# EAGLE design DRV8411A Module Rev. B (EAGLE 9.6.2)
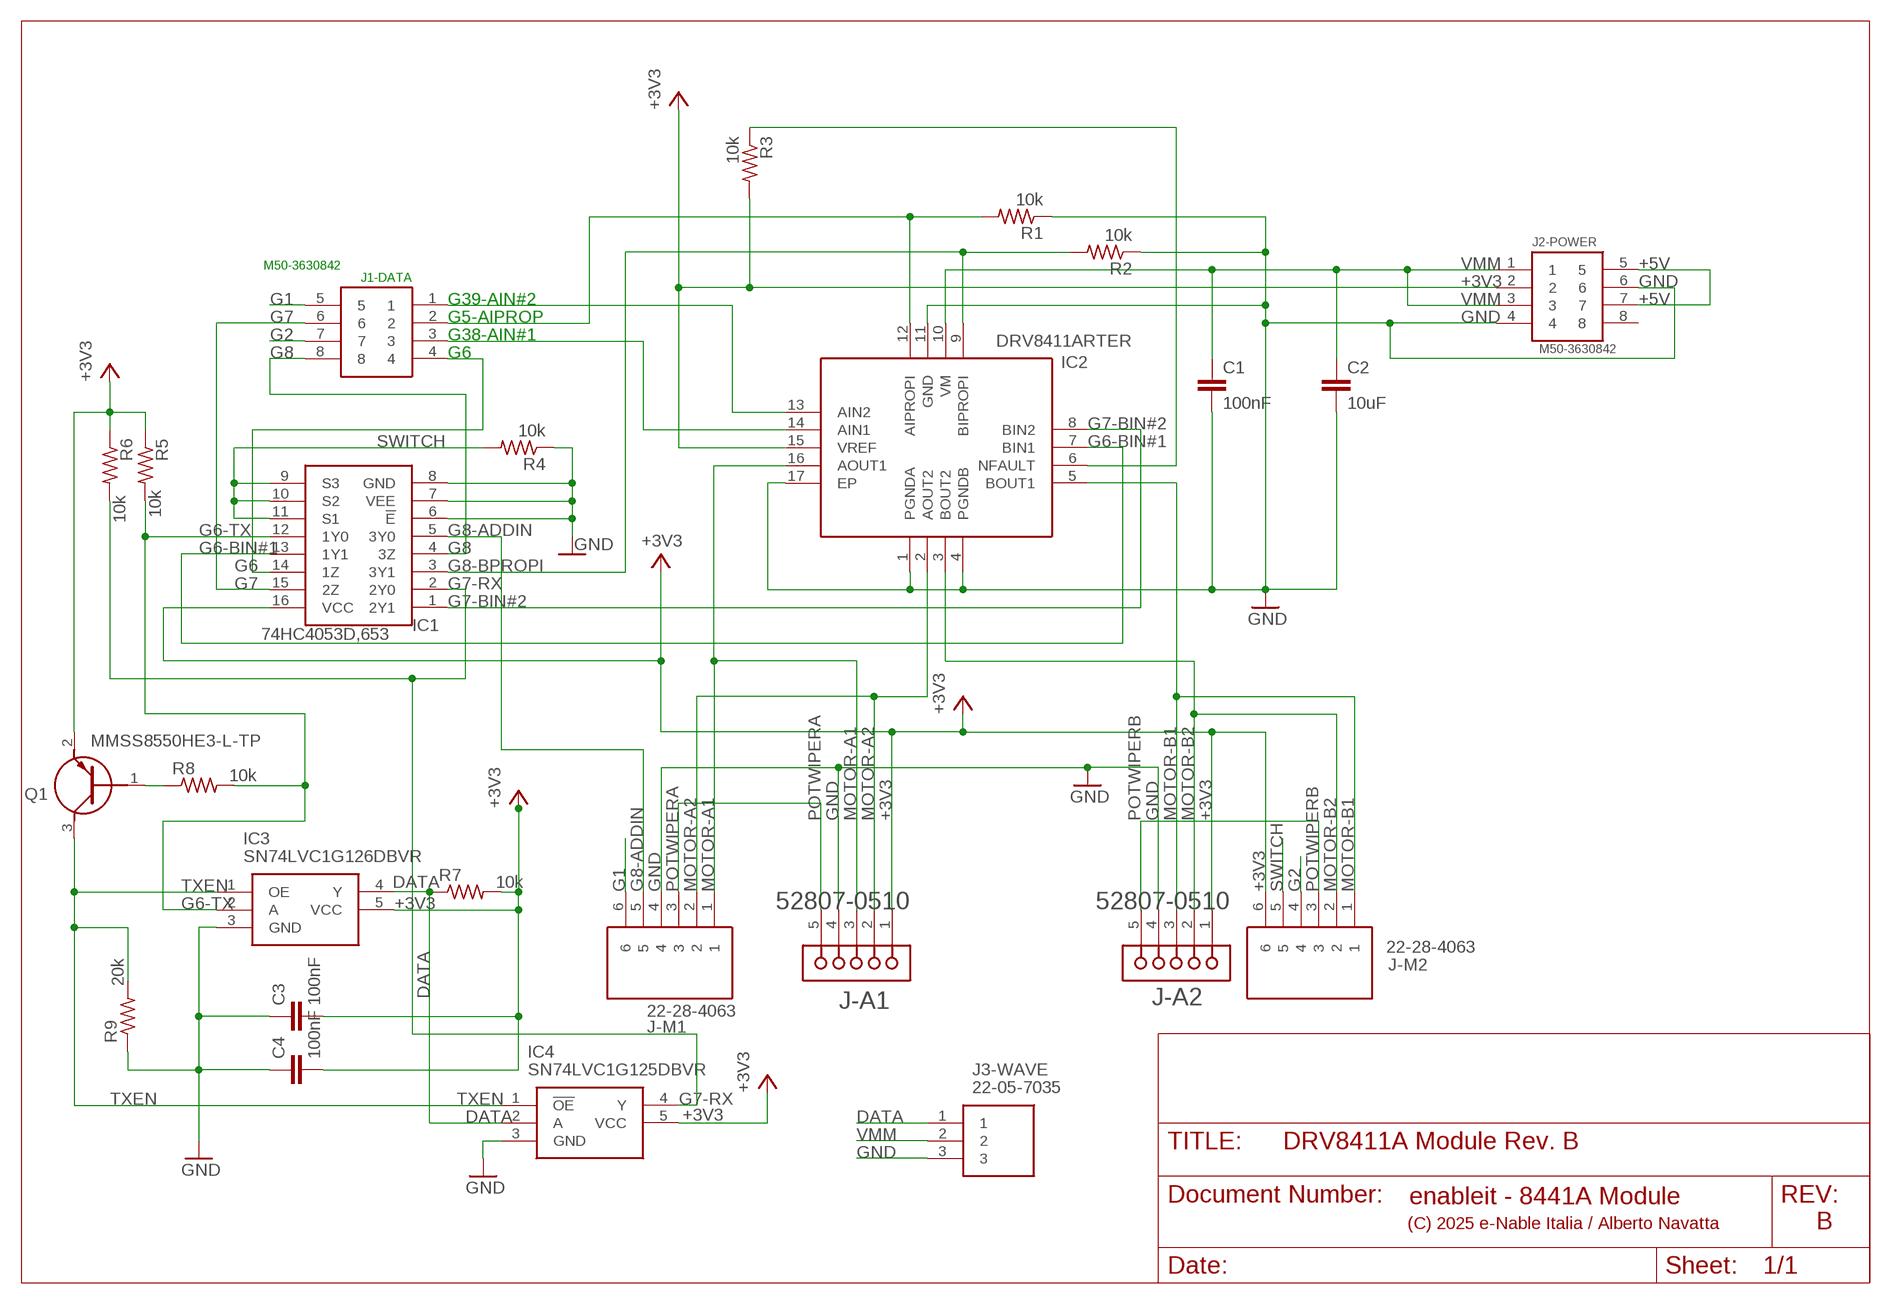
[diagram p0: schematic, sheet 1]

## Parts
C1  100nF  C-EUC0603  [C0603]
C2  10uF  C-EUC1206  [C1206]
C3  100nF  C-EUC0603  [C0603]
C4  100nF  C-EUC0603  [C0603]
IC1  74HC4053D,653  [SOIC127P600X175-16N]
IC2  DRV8411ARTER  [QFN50P300X300X80-17N]
IC3  SN74LVC1G126DBVR  [SOT95P280X145-5N]
IC4  SN74LVC1G125DBVR  [SOT95P280X145-5N]
J1-DATA  M50-3630842  [HUSRSP8W42P127_1016X210X430P]
J2-POWER  M50-3630842  [HUSRSP8W42P127_1016X210X430P]
J3-WAVE  22-05-7035  [SHDRRA3W60P0X250_1X3_990X790X4]
J-A1  MOLEX_52807-0510MOLEX_52807-0510_0_0  [MOLEX_52807-0510_0]
J-A2  MOLEX_52807-0510MOLEX_52807-0510_0_0  [MOLEX_52807-0510_0]
J-M1  22-28-4063  [HDRV6W66P0X254_1X6_1524X249X83]
J-M2  22-28-4063  [HDRV6W66P0X254_1X6_1524X249X83]
Q1  MMSS8550HE3-L-TP  [SOT95P237X125-3N]
R1  10k  R-US_R1206  [R1206]
R2  10k  R-US_R1206  [R1206]
R3  10k  R-US_R1206  [R1206]
R4  10k  R-US_R1206  [R1206]
R5  10k  R-US_R1206  [R1206]
R6  10k  R-US_R1206  [R1206]
R7  10k  R-US_R1206  [R1206]
R8  10k  R-US_R1206  [R1206]
R9  20k  R-US_R1206  [R1206]

## Nets
+3V3: C3.2 C4.2 IC1.16(VCC) IC2.15(VREF) IC3.5(VCC) IC4.5(VCC) J2-POWER.2 J-A1.1 J-A2.1 J-M2.6 Q1.2(E) R3.2 R5.1 R6.1 R7.2
+5V: J2-POWER.5 J2-POWER.7
DATA: IC3.4(Y) IC4.2(A) J3-WAVE.1 R7.1
G1: J1-DATA.5 J-M1.6
G2: J1-DATA.7 J-M2.4
G5-AIPROP: IC2.12(AIPROPI) J1-DATA.2 R1.2
G6: IC1.14(1Z) J1-DATA.4
G6-BIN#1: IC1.13(1Y1) IC2.7(BIN1)
G6-TX: IC1.12(1Y0) IC3.2(A) R5.2 R8.2
G7: IC1.15(2Z) J1-DATA.6
G7-BIN#2: IC1.1(2Y1) IC2.8(BIN2)
G7-RX: IC1.2(2Y0) IC4.4(Y) R6.2
G8: IC1.4(3Z) J1-DATA.8
G8-ADDIN: IC1.5(3Y0) J-M1.5
G8-BPROPI: IC1.3(3Y1) IC2.9(BIPROPI) R2.2
G38-AIN#1: IC2.14(AIN1) J1-DATA.3
G39-AIN#2: IC2.13(AIN2) J1-DATA.1
GND: C1.2 C2.2 C3.1 C4.1 IC1.6(!E) IC1.7(VEE) IC1.8(GND) IC2.1(PGNDA) IC2.4(PGNDB) IC2.11(GND) IC2.17(EP) IC3.3(GND) IC4.3(GND) J2-POWER.4 J2-POWER.6 J3-WAVE.3 J-A1.4 J-A2.4 J-M1.4 R1.1 R2.1 R4.1 R9.1
MOTOR-A1: IC2.16(AOUT1) J-A1.3 J-M1.1
MOTOR-A2: IC2.2(AOUT2) J-A1.2 J-M1.2
MOTOR-B1: IC2.5(BOUT1) J-A2.3 J-M2.1
MOTOR-B2: IC2.3(BOUT2) J-A2.2 J-M2.2
N$1: Q1.1(B) R8.1
NFAULT: IC2.6(NFAULT) R3.1
POTWIPERA: J-A1.5 J-M1.3
POTWIPERB: J-A2.5 J-M2.3
SWITCH: IC1.9(S3) IC1.10(S2) IC1.11(S1) J-M2.5 R4.2
TXEN: IC3.1(OE) IC4.1(!OE) Q1.3(C) R9.2
VMM [Power]: C1.1 C2.1 IC2.10(VM) J2-POWER.1 J2-POWER.3 J3-WAVE.2
Unconnected: J2-POWER.8

## Notes on the sheet
- enableit - 8441A Module
- (C) 2025 e-Nable Italia / Alberto Navatta | B

## Library data of the parts
C1-C4 = rcl:C-EU: CAPACITOR, European symbol; SPICEPREFIX: C
IC1 = SamacSys_Parts:74HC4053D,653: 74HC(T)4053 - Triple 2-channel analog multiplexer/demultiplexer@en-us Source: Datasheet <https://assets.nexperia.com/documents/data-sheet/74HC_HCT4053.pdf>; DESCRIPTION: 74HC(T)4053 - Triple 2-channel analog multiplexer/demultiplexer@en-us; HEIGHT: 1.75mm; MANUFACTURER_NAME: Nexperia; MANUFACTURER_PART_NUMBER: 74HC4053D,653; MOUSER_PART_NUMBER: 771-74HC4053D-T; MOUSER_PRICE-STOCK: https://www.mouser.co.uk/ProductDetail/Nexperia/74HC4053D653?qs=P62ublwmbi%2F49q4%252B0dLSpg%3D%3D
IC2 = SamacSys_Parts:DRV8411ARTER: Motor / Motion / Ignition Controllers & Drivers 1.65-V to 11-V, 4-A dual H-bridge motor driver with IPROPI current regulation Source: Datasheet <https://www.ti.com/product/DRV8411A/part-details/DRV8411ARTER>; DESCRIPTION: Motor / Motion / Ignition Controllers & Drivers 1.65-V to 11-V, 4-A dual H-bridge motor driver with IPROPI current regulation; HEIGHT: 0.8mm; MANUFACTURER_NAME: Texas Instruments; MANUFACTURER_PART_NUMBER: DRV8411ARTER; MOUSER_PART_NUMBER: 595-DRV8411ARTER; MOUSER_PRICE-STOCK: https://www.mouser.co.uk/ProductDetail/Texas-Instruments/DRV8411ARTER?qs=Jm2GQyTW%2FbhTQDH4ldRJVg%3D%3D
IC3 = SamacSys_Parts:SN74LVC1G126DBVR: Texas Instruments SN74LVC1G126DBVR, Buffer 3-State, Non-Inverting, 1.65 5.5 V, 5-Pin SOT-23 Source: Datasheet <http://www.ti.com/lit/ds/symlink/sn74lvc1g126.pdf>; DESCRIPTION: Texas Instruments SN74LVC1G126DBVR, Buffer 3-State, Non-Inverting, 1.65 5.5 V, 5-Pin SOT-23; HEIGHT: 1.45mm; MANUFACTURER_NAME: Texas Instruments; MANUFACTURER_PART_NUMBER: SN74LVC1G126DBVR; MOUSER_PART_NUMBER: 595-SN74LVC1G126DBVR; MOUSER_PRICE-STOCK: https://www.mouser.co.uk/ProductDetail/Texas-Instruments/SN74LVC1G126DBVR?qs=pajgIaoyDUi3T2WgNNfd3w%3D%3D
IC4 = SamacSys_Parts:SN74LVC1G125DBVR: SN74LVC1G125DBVR, Bus Buffer, LVC, 4 @ 5 Vns, 32mA 1.65 to 5.5V 5-Pin SOT-23 Source: Datasheet <http://www.ti.com/lit/ds/symlink/sn74lvc1g125.pdf>; DESCRIPTION: SN74LVC1G125DBVR, Bus Buffer, LVC, 4 @ 5 Vns, 32mA 1.65 to 5.5V 5-Pin SOT-23; HEIGHT: 1.45mm; MANUFACTURER_NAME: Texas Instruments; MANUFACTURER_PART_NUMBER: SN74LVC1G125DBVR; MOUSER_PART_NUMBER: 595-SN74LVC1G125DBVR; MOUSER_PRICE-STOCK: https://www.mouser.co.uk/ProductDetail/Texas-Instruments/SN74LVC1G125DBVR?qs=dT9u2OTAaVWCjkJK89JQQg%3D%3D
J1-DATA J2-POWER = SamacSys_Parts:M50-3630842: 1.27mm (0.05") Pitch SIL Vertical SMT Pin Header, selective gold + tin, 8 contacts Source: Datasheet <https://cdn.harwin.com/pdfs/M50-363.pdf>; DESCRIPTION: 1.27mm (0.05") Pitch SIL Vertical SMT Pin Header, selective gold + tin, 8 contacts; HEIGHT: mm; MANUFACTURER_NAME: Harwin; MANUFACTURER_PART_NUMBER: M50-3630842; MOUSER_PART_NUMBER: 855-M50-3630842; MOUSER_PRICE-STOCK: https://www.mouser.co.uk/ProductDetail/Harwin/M50-3630842?qs=%252BdQmOuGyFcFqwDSPVZ2BSw%3D%3D
J3-WAVE = SamacSys_Parts:22-05-7035: Headers & Wire Housings 3 CKT 2.5MM R/A HDR Source: Datasheet <https://www.molex.com/pdm_docs/sd/022057035_sd.pdf>; DESCRIPTION: Headers & Wire Housings 3 CKT 2.5MM R/A HDR; HEIGHT: 4.9mm; MANUFACTURER_NAME: Molex; MANUFACTURER_PART_NUMBER: 22-05-7035; MOUSER_PART_NUMBER: 538-22-05-7035; MOUSER_PRICE-STOCK: https://www.mouser.co.uk/ProductDetail/Molex/22-05-7035?qs=Crveo0%2FlhpeTQWWlghVCyA%3D%3D
J-A1 J-A2 = Molex - 52807-0510:MOLEX_52807-0510: MOLX-52807-0510; CIIVA_IDS: 3407603; CIRCUITS_LOADED: 5; COMPONENT_LINK_1_DESCRIPTION: Manufacturer URL; COMPONENT_LINK_1_URL: http://www.molex.com/molex/index.jsp; COMPONENT_LINK_3_DESCRIPTION: Package Specification; COMPONENT_LINK_3_URL: http://www.molex.com/pdm_docs/sd/528070510_sd.pdf; CONTACT_POSITION: Top; CURRENT_MAX_PER_CONTACT: 0.2A, 0.4A, 0.5A; DATASHEET: http://www.molex.com/webdocs/datasheets/pdf/en-us/0528070510_FFC_FPC_CONNECTORS.pdf; ENTRY_ANGLE: 90degrees Angle; FOOTPRINT_VARIANT_NAME_0: Manufacturer Recommended; IMPORTED: yes; IMPORTED_FROM: vault; IMPORT_TS: 1521841804; MATED_HEIGHT: 3.60mm; MATERIAL___METAL: Phosphor Bronze; MATERIAL___PLATING_MATING: Tin; MATERIAL___PLATING_TERMINATION: Tin; MF: Molex; MOUNTING_TECHNOLOGY: Through Hole; MPN: 52807-0510; NUMBER_OF_ROWS: 1; ORIENTATION: Right Angle; PACKAGE: 52807-0510; PACKAGE_DESCRIPTION: 5-Lead FFC Connector, Pitch 1.0 mm; PACKAGE_VERSION: Rev. B, 08/2002; PACKING: Tray; PCB_RETENTION: None; PITCH___MATING_INTERFACE: 1.00mm; PITCH___TERMINATION_INTERFACE: 1.00mm; POLARIZED_TO_PCB: Yes; PREFIX: J; RELEASE_DATE: 1411372626; ROHS: Yes; STACKABLE: No; VAULT_GUID: C91CB896-1E32-4DB6-8F6C-FD3BFAFEC20D; VAULT_REVISION: BD038269-A002-43D0-B0A9-6B73FA1A6DCF; VOLTAGE_MAX: 50V
J-M1 J-M2 = SamacSys_Parts:22-28-4063: Headers & Wire Housings BREAKAWAY HDR VERT 6 Source: Datasheet <https://www.molex.com/pdm_docs/sd/022284063_sd.pdf>; DESCRIPTION: Headers & Wire Housings BREAKAWAY HDR VERT 6; HEIGHT: 8.38mm; MANUFACTURER_NAME: Molex; MANUFACTURER_PART_NUMBER: 22-28-4063; MOUSER_PART_NUMBER: 538-22-28-4063; MOUSER_PRICE-STOCK: https://www.mouser.co.uk/ProductDetail/Molex/22-28-4063?qs=MuwpYaHj750CQ%2FtWum2FiQ%3D%3D
Q1 = SamacSys_Parts:MMSS8550HE3-L-TP: Small Signal Bipolar Transistors Source: Datasheet <https://mccsemi.com/pdf/Products/MMSS8550HE3(SOT-23).pdf>; DESCRIPTION: Small Signal Bipolar Transistors; HEIGHT: 1.25mm; MANUFACTURER_NAME: MCC; MANUFACTURER_PART_NUMBER: MMSS8550HE3-L-TP; MOUSER_PART_NUMBER: 833-MMSS8550HE3-L-TP; MOUSER_PRICE-STOCK: https://www.mouser.co.uk/ProductDetail/Micro-Commercial-Components-MCC/MMSS8550HE3-L-TP?qs=HBWAp0VN4RgYknoAqeuZgg%3D%3D
R1-R9 = rcl:R-US_: RESISTOR, American symbol; SPICEPREFIX: R

## Net classes
2 Power: width 0.203 mm

## Board
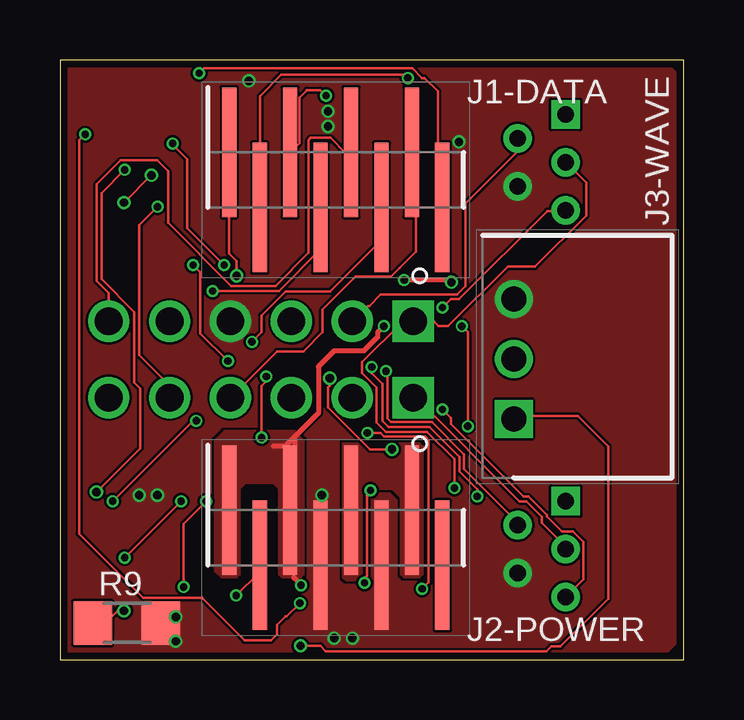
[diagram p1: board, top side]
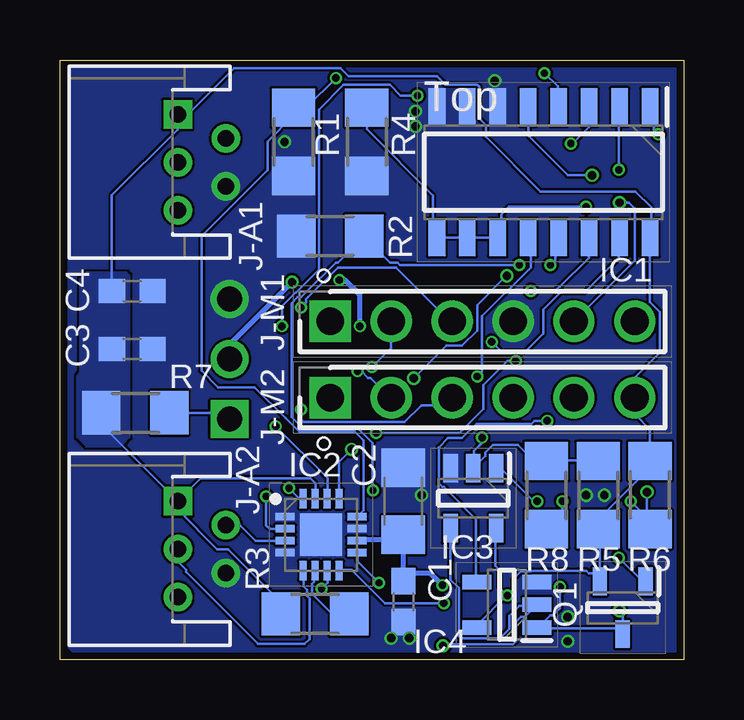
[diagram p2: board, bottom side, seen from below]

Size 26 x 25 mm. Coordinates in mm from the lower left corner, seen from the top.
Outline: 0,0 26,0 26,25 0,25 0,0
Copper layers (1*16): Top 0.035mm / dielectric 1.5mm / Bottom 0.035mm
Design rules "PCBWay_2L_100um-Track": minimum track width 0.1mm, minimum drill 0.3mm, track to track 0.1mm, track to pad 0.1mm, pad to pad 0.1mm, via to via 0.1mm, smd to smd 0mil, copper to edge 0.3mm, drill to drill 10mil, minimum pad ring 6mil, minimum via ring 0.1mm, stop-mask expansion 2mil, vias tented up to drill 0.45mm, thermal gap 0.2mm

### Footprints (pad centres in the part's own frame; a part is rotated, then mirrored left to right if it is on the bottom)
C0603 = smd 1.1 x 1: 1 -0.85,0; 2 0.85,0
C1206 = smd 1.6 x 1.8: 1 -1.4,0; 2 1.4,0
SOIC127P600X175-16N = smd 1.55 x 0.7: 1 -2.725,4.445; 2 -2.725,3.175; 3 -2.725,1.905; 4 -2.725,0.635; 5 -2.725,-0.635; 6 -2.725,-1.905; 7 -2.725,-3.175; 8 -2.725,-4.445; 9 2.725,-4.445; 10 2.725,-3.175; 11 2.725,-1.905; 12 2.725,-0.635; 13 2.725,0.635; 14 2.725,1.905; 15 2.725,3.175; 16 2.725,4.445
QFN50P300X300X80-17N = smd 0.8 x 0.3: 1 -1.5,0.75; 2 -1.5,0.25; 3 -1.5,-0.25; 4 -1.5,-0.75; 9 1.5,-0.75; 10 1.5,-0.25; 11 1.5,0.25; 12 1.5,0.75 | smd 0.3 x 0.8: 5 -0.75,-1.5; 6 -0.25,-1.5; 7 0.25,-1.5; 8 0.75,-1.5; 13 0.75,1.5; 14 0.25,1.5; 15 -0.25,1.5; 16 -0.75,1.5 | smd 1.76 x 1.76: 17 0,0
SOT95P280X145-5N = smd 1.2 x 0.6: 1 -1.25,0.95; 2 -1.25,0; 3 -1.25,-0.95; 4 1.25,-0.95; 5 1.25,0.95
HUSRSP8W42P127_1016X210X430P = smd 0.6 x 5.4: 1 -4.445,1.15; 2 -3.175,-1.15; 3 -1.905,1.15; 4 -0.635,-1.15; 5 0.635,1.15; 6 1.905,-1.15; 7 3.175,1.15; 8 4.445,-1.15
SHDRRA3W60P0X250_1X3_990X790X4 = drill 1.05 pad 1.575 square: 1 0,0 | drill 1.05 pad 1.575: 2 -2.5,0; 3 -5,0
MOLEX_52807-0510_0 = drill 0.7 pad 1.2 square: 1 0,0 | drill 0.7 pad 1.2: 2 1,2; 3 2,0; 4 3,2; 5 4,0
HDRV6W66P0X254_1X6_1524X249X83 = drill 1.15 pad 1.725 square: 1 0,0 | drill 1.15 pad 1.725: 2 2.54,0; 3 5.08,0; 4 7.62,0; 5 10.16,0; 6 12.7,0
SOT95P237X125-3N = smd 1.15 x 0.6: 1 -1.1,0.95; 2 -1.1,-0.95; 3 1.1,0
R1206 = smd 1.6 x 1.803: 1 -1.422,0; 2 1.422,0

### Placement (x,y rotation side)
C1  11.68,2.41 270 bottom
C2  11.68,6.6 90 bottom
C3  22.99,12.95 180 bottom
C4  22.99,15.37 180 bottom
IC1  5.84,20.32 270 bottom
IC2  15.11,5.21 0 bottom
IC3  8.76,6.73 270 bottom
IC4  7.37,2.29 180 bottom
J1-DATA  11.5,20 0 top
J2-POWER  11.5,5.08 0 top
J3-WAVE  18.92,10.03 270 top
J-A1  21.08,22.73 270 bottom
J-A2  21.08,6.6 270 bottom
J-M1  14.73,14.1 0 bottom
J-M2  14.73,10.92 0 bottom
Q1  2.54,2.16 270 bottom
R1  16.26,21.59 90 bottom
R2  14.73,17.65 0 bottom
R3  15.37,1.91 180 bottom
R4  13.21,21.59 90 bottom
R5  3.56,6.86 90 bottom
R6  1.4,6.86 270 bottom
R7  22.86,10.29 180 bottom
R8  5.71,6.86 90 bottom
R9  2.79,1.52 180 top

### Tracks (layer width: path | path; a pad name or v marks a point on that pad's centre or on a via)
+3V3  (via drill 0.3)
  Top 0.1: v7.35,2.67 8.3,3.62 8.3,3.9 J2-POWER.2
  Bottom 0.1: IC2.15 15.35,6.75 15.35,7.35 15.55,7.55 20.14,7.55 J-A2.1 | R3.2 16.8,1.95 16.8,2.4 19,4.6 19.45,4.6 21.08,6.23 J-A2.1 | IC3.5 7.85,5.45 7.85,3.9 7.65,3.7 7.65,2.97 v7.35,2.67 | IC4.5 8.6,1.35 8.6,1.45 7.38,2.67 v7.35,2.67 | 3.5,3.6 3.5,5.35 3.55,5.4 R5.1 3.55,5.85 1.4,8 1.4,8.25 R6.1 1.4,8.3 1.4,9.6 2,10.2 2,10.9 J-M2.6 2.05,10.95 2.05,11.75 1,12.8 1,14.5 1.4,14.9 1.4,17.55 IC1.16 1.35,17.6 1.35,18.86 2,19.51 5.96,19.51 8.25,21.8 8.25,22.29 8.52,22.56 8.52,23.88 8.61,23.97 9.93,23.97 10.16,24.2 10.29,24.33 13.98,24.33 14.3,24.65 18.75,24.65 20.65,22.75 21.05,22.75 J-A1.1 21.1,22.7 21.1,22.1 23.84,19.36 C4.2 | 3.5,3.6 3.5,3.3 Q1.2 3.5,3.6 | 3.5,3.6 3.95,3.6 4.05,3.7 6.35,3.7 6.36,3.69 6.78,3.69 7.09,3.37 7.09,2.92 v7.35,2.67 | J-A2.1 24.28,9.8 R7.2
  pour Bottom (no thermals): 23.24,16.13 24.89,16.13 25.15,15.88 25.15,11.94 25.27,11.81 25.27,9.27 24.89,8.89 23.5,8.89 23.37,9.02 23.11,9.27 23.11,16
+5V
  pour Top (no thermals): 11.81,9.02 11.81,3.43 11.94,3.3 12.32,3.3 12.57,3.56 12.57,6.86 12.83,7.11 13.84,7.11 14.22,6.73 14.22,3.56 14.35,3.43 14.99,3.43 15.11,3.56 15.11,8.89 14.99,9.02
DATA  (via drill 0.35)
  Top 0.1: J3-WAVE.1 19.05,10.16 21.59,10.16 22.86,8.89 22.86,2.54 20.87,0.55 20.49,0.55 20.29,0.35 11.08,0.35 10.86,0.57 v10.03,0.57
  Bottom 0.1: 9.7,5.45 IC3.4 9.71,3.33 9.37,2.98 9.37,0.97 9.28,0.89 7.66,0.89 7.27,1.28 7.27,1.83 6.85,2.25 6.15,2.25 IC4.2 6.62,1.79 6.78,1.79 6.99,1.58 6.99,0.76 7.11,0.64 9.97,0.64 v10.03,0.57 | 21.18,10.03 R7.1 19.18,10.29 J3-WAVE.1
G1
  Top 0.1: J1-DATA.5 12.1,21.1 11.93,21.1 11.27,21.75 10.46,21.75 10.37,21.66 10.37,16.97 8.98,15.58 7.14,15.58 4.5,18.22 4.5,20.37 4.06,20.82 2.53,20.82 1.54,19.82 1.54,15.78 2.03,15.29 J-M1.6
G2
  Top 0.1: J-M2.4 7.15,10.95 9.05,12.85 10.15,12.85 10.95,13.65 10.95,14.6 12.31,15.96 13.81,15.96 14.16,16.32 14.85,17 14.85,20.95 14.7,21.1 J1-DATA.7
G5-AIPROP  (via drill 0.3)
  Top 0.1: v14.5,24.25 14.37,24.38 9.23,24.38 8.35,23.5 8.35,18.9 J1-DATA.2
  Bottom 0.1: v14.5,24.25 15.7,23.05 16.25,23.05 R1.2 16.3,23 16.3,22.65 17.35,21.6 17.35,20.4 20.1,17.65 20.1,12.05 19.4,11.35 17.88,11.35 16.6,10.07 16.04,9.5 13.72,9.5 13.35,9.13 13.35,7.22 | 13.35,7.22 | IC2.12 13.35,6.22 13.35,7.22
G6  (via drill 0.3)
  Top 0.1: v6.37,15.37 9.13,15.37 10.85,17.09 10.85,18.85 J1-DATA.4
  Bottom 0.1: IC1.14 3.95,17.55 3.95,16.75 5.15,15.55 5.18,15.55 5.36,15.37 v6.37,15.37
G6-BIN#1  (via drill 0.3)
  Top 0.1: v7,12.45 5.85,13.6 5.85,16.15 v5.55,16.45 | v12.81,9.45 13.37,9.45 13.52,9.3 15.21,9.3 15.37,9.14 15.37,3.22 v15.1,2.95
  Bottom 0.1: v15.1,2.95 14.85,3.2 IC2.7 | v12.81,9.45 9.35,9.45 8.35,10.45 8.35,11.45 7.35,12.45 v7,12.45 | v5.55,16.45 5.35,16.65 5.35,17.45 5.25,17.55 IC1.13
G6-TX  (via drill 0.3)
  Top 0.1: v8.6,11.8 8.6,11.6 8.4,11.4 v8.4,9.25
  Bottom 0.1: 8.75,8 8.75,8.7 8.53,8.91 8.5,8.95 8.4,9.05 v8.4,9.25 | 8.75,8 IC3.2 | IC1.12 6.37,17.49 6.37,16.35 8.4,14.32 8.4,12 v8.6,11.8 | R5.2 3.6,8.3 5.7,8.3 R8.2 5.75,8.3 6.25,8.3 6.9,8.95 7.96,8.95 8.26,8.64 8.26,8.49 8.75,8
G7  (via drill 0.3)
  Top 0.1: v8,13.25 8.4,13.65 8.4,14.35 9.4,15.35 11.25,15.35 13.4,17.5 J1-DATA.6
  Bottom 0.1: v8,13.25 7.6,12.85 6.6,12.85 5.85,13.6 5.85,14.6 5.14,15.3 5.1,15.35 4.1,15.35 2.7,16.75 2.7,17.55 IC1.15
G7-BIN#2  (via drill 0.3)
  Top 0.1: v10,2.35 9.45,1.8 9.4,1.8 9.05,1.45 9.05,1.05 8.8,0.8 7.7,0.8 5.92,2.58 3.47,2.58 0.8,5.25 0.8,21.65 v1.05,21.9
  Bottom 0.1: v10,2.35 12.45,2.35 13.85,3.75 14.35,3.75 IC2.8 | v1.05,21.9 1.25,22.1 1.25,22.9 1.35,23 IC1.1
G7-RX  (via drill 0.3, 0.35)
  Top 0.1: v2.2,6.6 5.56,9.96 v5.68,9.96 | v2.7,20.42 1.74,19.46 1.74,15.86 3.1,14.5 3.1,11.55 3.35,11.3 3.35,8.81 v1.52,6.99
  Bottom 0.1: v2.2,6.6 1.4,5.8 R6.2 1.52,5.56 v1.52,6.99 | IC4.4 8.65,3.25 8.65,5.85 10,7.2 10.05,7.2 10.2,7.35 10.2,8.85 9.82,9.23 9.23,9.23 8.64,9.83 6.35,9.83 6.22,9.96 v5.68,9.96 | v2.7,20.42 2.7,23 IC1.2
G8  (via drill 0.3)
  Top 0.1: v5.8,24.45 6,24.65 14.7,24.65 15.1,24.25 15.2,24.25 15.75,23.7 15.75,19.05 15.9,18.9 J1-DATA.8
  Bottom 0.1: v5.8,24.45 5.25,23.9 5.25,23.05 IC1.4
G8-ADDIN  (via drill 0.35)
  Top 0.1: v2.67,19.05 v3.81,20.19
  Bottom 0.1: IC1.5 6.48,21.84 4.83,20.19 v3.81,20.19 | J-M1.5 2.03,16.64 2.03,18.8 2.29,19.05 v2.67,19.05
G8-BPROPI  (via drill 0.3)
  Top 0.1: v12.7,3.2 12.7,3.4 12.8,3.5 12.8,6.9 v12.95,7.05 | v6.84,16.45 5.29,17.99 5.29,20.87 4.7,21.46 v4.7,21.52
  Bottom 0.1: v12.7,3.2 13.6,4.1 IC2.9 | R2.2 13.34,17.65 13.35,17.65 12.25,16.55 11.92,16.55 11.82,16.45 v6.84,16.45 | v4.7,21.52 4.63,21.52 3.95,22.2 3.95,23 IC1.3 | 13,17.65 R2.2 | v12.95,7.05 12.95,7.24 12.96,7.25 12.96,9.02 13.64,9.7 15.94,9.7 16.35,10.12 16.35,14.85 16.09,15.11 15.94,15.11 14.5,16.55 14.41,16.55 R2.2
G38-AIN#1  (via drill 0.3)
  Top 0.1: v16.75,13.9 17,13.65 v17,9.73 | J1-DATA.3 9.99,21.54 9.99,23.42 10.29,23.71 10.29,23.75 10.85,23.75 v11.09,23.51
  Bottom 0.1: v17,9.73 14.85,7.57 14.85,6.75 IC2.14 | v16.75,13.9 16.75,14.73 16.18,15.29 16.17,15.31 16.15,15.31 15.2,16.25 15.2,22.93 14.17,23.96 12.24,23.96 11.79,23.51 v11.09,23.51
G39-AIN#2  (via drill 0.35)
  Top 0.1: v13.84,8.76 12.92,8.76 11.18,10.5 11.18,11.34 11.25,11.41 v11.25,11.73 | v7.37,16 7.37,16.62 7.05,16.93 J1-DATA.1
  Bottom 0.1: IC2.13 14.36,8.24 v13.84,8.76 | v11.25,11.73 9.89,13.09 9.23,13.09 8.6,13.72 8.6,14.78 7.38,16 v7.37,16
GND  (via drill 0.35)
  other vias: 11.43,0.89 12.19,0.89 16.64,21.59 10.92,6.86 11.18,22.23 7.87,24.13 4.83,0.76 4.83,1.78 3.3,6.86 4.06,6.86 11.18,22.86
  pour Bottom (no thermals): 14.22,5.08 14.1,5.21 13.21,5.21 13.21,5.71 14.22,5.71 14.22,6.1 16.89,6.1 16.89,5.84 16,5.84 16,4.57 17.02,4.57 17.02,4.32 14.22,4.32
  pour Top (no thermals): 10.41,7.75 10.67,8 11.3,8 11.3,2.54 12.19,1.65 12.83,2.29 12.83,6.6 13.08,6.86 13.72,6.86 13.97,6.6 13.97,0.89 13.84,0.76 10.67,0.76 10.41,1.02
  pour Bottom (rank 3, no thermals): 0.25,24.77 25.65,24.77 25.65,0.51 25.27,0.13 0.13,0.13 0.13,24.64
  pour Top (rank 3, no thermals): 0.38,24.77 25.4,24.77 25.78,24.38 25.78,0.76 25.27,0.25 0.38,0.25 0.25,0.38 0.25,24.64
MOTOR-A1  (via drill 0.3)
  Top 0.1: v16.45,7.15 16.45,8.36 15.31,9.5 13.6,9.5 13.2,9.9 13.2,11.34 12.6,11.95 12.6,12.4 14.25,14.05 14.69,14.05 J-M1.1 15.59,14.1 15.78,13.9 16.18,13.9 18.67,16.38 19.81,16.38 21.94,18.51 21.94,19.88 J-A1.3
  Bottom 0.1: v16.45,7.15 16.05,6.75 15.9,6.75 IC2.16
MOTOR-A2  (via drill 0.3)
  Top 0.1: v17.4,6.8 17.4,7.1 16.65,7.85 16.65,8.46 15.41,9.7 13.7,9.7 13.45,9.95 13.45,11.49 13,11.94 v13,12.2 | J-A1.2 19.05,21.7 19.05,21.15 16.9,19 16.9,15.57 16.56,15.22 13.37,15.22 12.9,14.75 12.85,14.75 J-M1.2
  Bottom 0.1: v17.4,6.8 17.4,5.6 17.25,5.45 16.65,5.45 IC2.2 | v13,12.2 12.2,12.99 12.2,14.05 J-M1.2
MOTOR-B1
  Top 0.1: J-A2.3 21.05,4.65 21.05,4.75 20.1,5.7 20.1,5.95 19.45,6.6 19.16,6.6 14.84,10.92 J-M2.1
  Bottom 0.1: IC2.5 15.85,3.05 15.7,2.9 15.7,2.65 15.6,2.55 15.6,0.85 15.8,0.65 17.75,0.65 20.75,3.65 20.75,3.75 21.05,4.05 21.05,4.6 J-A2.3
MOTOR-B2  (via drill 0.3)
  Top 0.1: v13.6,12.02 13.65,12.02 13.65,10.05 13.8,9.9 15.51,9.9 16.85,8.56 16.85,7.95 19.05,5.75 19.05,5.65 J-A2.2
  Bottom 0.1: IC2.3 16.65,4.95 17.85,4.95 18.5,5.6 19.05,5.6 J-A2.2 | v13.6,12.02 13.42,12.02 13.15,11.75 13.05,11.75 12.2,10.9 J-M2.2
N$1  (via drill 0.3)
  Top 0.1: v5.05,6.6 v2.7,4.25
  Bottom 0.1: v2.7,4.25 1.75,3.3 1.6,3.3 Q1.1 | v5.05,6.6 5.05,6.1 R8.1
NFAULT
  Bottom 0.1: IC2.6 15.4,3.7 15.4,3.25 15.5,3.15 15.5,2.75 14.7,1.95 13.95,1.95 R3.1
POTWIPERA  (via drill 0.3)
  Top 0.1: J-A1.5 21.05,18.7 20.32,18.7 16.64,15.02 16.29,15.02 v15.95,14.68
  Bottom 0.1: J-M1.3 9.7,14.05 12,16.35 14.41,16.35 15.65,15.11 15.66,15.11 15.74,15.02 15.74,14.89 v15.95,14.68
POTWIPERB  (via drill 0.3)
  Top 0.1: J-A2.5 21.83,3.35 21.83,4.92 21.39,5.35 20.92,5.35 20.3,5.97 20.3,6.03 19.53,6.8 19.33,6.8 16.3,9.83 16.3,10.07 v15.95,10.43
  Bottom 0.1: v15.95,10.43 15.95,10 15.85,9.9 11.63,9.9 10.93,10.6 10.45,10.6 10.15,10.9 9.7,10.9 J-M2.3
SWITCH  (via drill 0.3)
  Top 0.1: v4.06,18.88 3.3,18.11 3.3,12.7 4.55,11.45 4.55,10.95 J-M2.5
  Bottom 0.1: v4.06,18.88 7.27,18.88 7.6,18.55 7.6,17.8 7.75,17.65 IC1.11 9,17.6 IC1.10 9.05,17.6 10.25,17.6 IC1.9 10.25,17.65 10.45,17.85 10.45,19.35 13.21,22.11 R4.2
TXEN  (via drill 0.3, 0.35)
  Top 0.1: v6.1,6.6 5.15,5.65 v5.15,3.02 | v2.67,2.03 2.41,2.03 1.91,1.52 R9.2
  Bottom 0.1: IC4.1 6.08,1.3 | 6.08,1.3 2.79,1.3 Q1.3 2.54,1.91 v2.67,2.03 | v6.1,6.6 6.25,6.6 7.6,7.95 7.8,7.95 IC3.1 | 6.08,1.3 5.55,1.84 5.45,1.84 5.15,2.14 v5.15,3.02
VMM  (via drill 0.3, 0.35)
  Top 0.203: v10.05,3.1 9.75,3.4 9.75,3.43 | v13.5,13.9 13.25,13.65 13.25,13.45 12.69,12.88 11.45,12.88 10.77,12.21 10.77,10.27 9.78,9.28 | v16.32,15.73 16.24,15.82 v14.35,15.82 | 9.78,9.28 9.39,8.89 8.89,8.89 | 9.78,9.28 9.78,6.4 J2-POWER.3
  Bottom 0.203: IC2.10 13.6,5 11.9,5 11.7,5.2 C2.1 11.9,4.9 11.7,4.7 11.7,3.3 C1.1 11.6,3.6 10.55,3.6 v10.05,3.1 | v14.35,15.82 14.12,15.82 13.5,15.2 v13.5,13.9 | J3-WAVE.2 18.9,12.55 18.9,13.16 v16.32,15.73
  pour Top (rank 2, no thermals): 6.86,9.53 9.78,9.53 10.16,9.14 10.16,3.56 10.03,3.43 9.27,3.43 9.14,3.56 9.14,7.11 8.89,7.37 7.75,7.37 7.49,7.11 7.49,3.56 7.37,3.43 6.73,3.43 6.48,3.68 6.48,9.14

### Text on the board
bNames: ⇦ Top